# EAGLE design gyroscope-breakout (EAGLE 9.6.2)
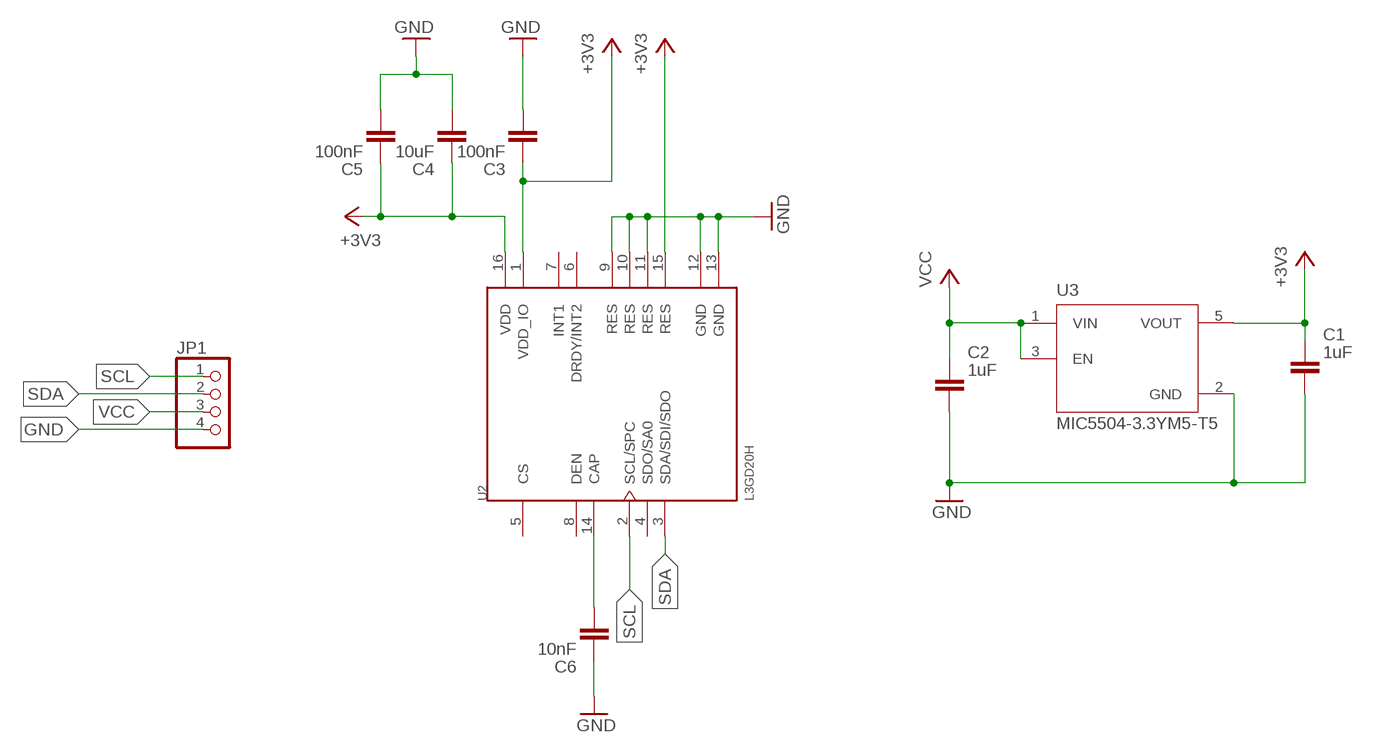
[diagram p0: schematic, sheet 1]

## Parts
C1  1uF  C_CHIP-1206(3216-METRIC)  [CAPC3216X135]
C2  1uF  C_CHIP-1206(3216-METRIC)  [CAPC3216X135]
C3  100nF  C_CHIP-1206(3216-METRIC)  [CAPC3216X135]
C4  10uF  C_CHIP-1206(3216-METRIC)  [CAPC3216X135]
C5  100nF  C_CHIP-1206(3216-METRIC)  [CAPC3216X135]
C6  10nF  C_CHIP-1206(3216-METRIC)  [CAPC3216X135]
JP1  PINHD-1X4  [1X04]
U2  L3GD20H  [LGA16R50P7X5_300X300X100]
U3  MIC5504-3.3YM5-T5  [SOT95P280X145-5N]

## Nets
+3V3: C1.1 C3.1 C4.1 C5.1 U2.1(VDD_IO) U2.15(RES) U2.16(VDD) U3.5(VOUT)
GND: C1.2 C2.2 C3.2 C4.2 C5.2 C6.1 JP1.4 U2.9(RES) U2.10(RES) U2.11(RES) U2.12(GND) U2.13(GND) U3.2(GND)
N$1: C6.2 U2.14(CAP)
SCL: JP1.1 U2.2(SCL/SPC)
SDA: JP1.2 U2.3(SDA/SDI/SDO)
VCC: C2.1 JP1.3 U3.1(VIN) U3.3(EN)
Unconnected: U2.4(SDO/SA0) U2.5(CS) U2.6(DRDY/INT2) U2.7(INT1) U2.8(DEN)

## Library data of the parts
C1-C6 = Capacitor:C: Capacitor - Generic; CATEGORY: Capacitor
JP1 = pinhead:PINHD-1X4: PIN HEADER
U2 = L3GD20H:L3GD20H: MEMS motion sensor: three-axis digital output gyroscope Buy Part <https://snapeda.com/parts/L3GD20H/STMicroelectronics/view-part/?ref=eda>; AVAILABILITY: Bad; DESCRIPTION: Gyroscope X (Pitch), Y (Roll), Z (Yaw) ±245, 500, 2000 6.25Hz ~ 400Hz I²C, SPI 16-LGA (3x3); MF: STMicroelectronics; MP: L3GD20H; PACKAGE: LGA-16 STMicroelectronics; PRICE: None
U3 = MIC5504-3.3YM5-T5:MIC5504-3.3YM5-T5: Linear Voltage Regulator IC 1 Output 300mA SOT-23-5 Buy Part <https://snapeda.com/parts/MIC5504-3.3YM5-T5/Microchip/view-part/?ref=eda>; ARROW_ELECTRONICS-PURCHASE-URL: https://snapeda.com/shop?store=Arrow+Electronics&id=1219468; AVAILABILITY: Good; DESCRIPTION: Linear Voltage Regulator IC 1 Output 300mA SOT-23-5; DIGIKEY-PURCHASE-URL: https://snapeda.com/shop?store=DigiKey&id=1219468; MF: Microchip; MOUSER-PURCHASE-URL: https://snapeda.com/shop?store=Mouser&id=1219468; MP: MIC5504-3.3YM5-T5; PACKAGE: SOT-23-5 Microchip; PRICE: None

## Board
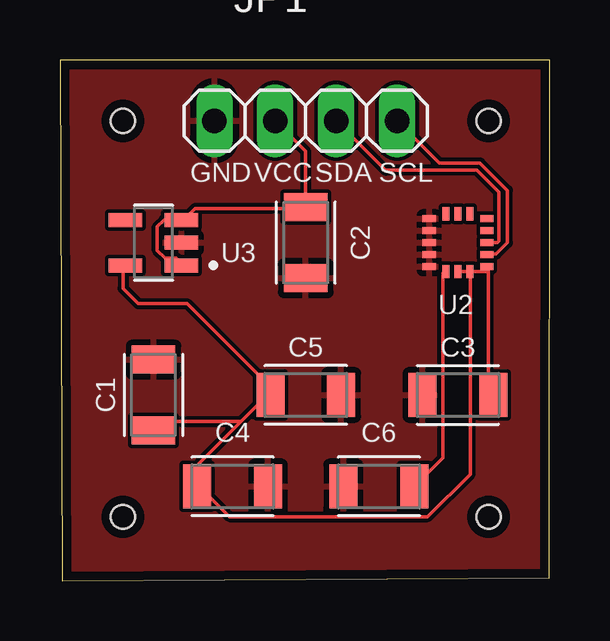
[diagram p1: board, top side]

Size 20.43 x 21.72 mm. Coordinates in mm from the lower left corner, seen from the top.
Outline: 0.09,0 20.41,0.13 20.43,21.72 0,21.72 0.09,0
Copper layers (1*16): Top 0.035559375mm / dielectric 1.6mm / Bottom 0.035559375mm
Design rules "oshpark-2layer": minimum track width 6mil, minimum drill 10mil, track to track 6mil, track to pad 6mil, pad to pad 6mil, via to via 6mil, smd to smd 6mil, copper to edge 15mil, drill to drill 6mil, minimum pad ring 5mil, minimum via ring 5mil, stop-mask expansion 2.5mil, vias tented up to drill 0mil, thermal gap 10mil
Holes 1 mm at 2.63,19.18 2.63,2.67 17.87,2.67 17.87,19.18

### Footprints (pad centres in the part's own frame; a part is rotated, then mirrored left to right if it is on the bottom)
CAPC3216X135 = smd 1.165 x 1.815: 1 -1.475,0; 2 1.475,0
1X04 = drill 1.016 long: 1 -3.81,0; 2 -1.27,0; 3 1.27,0; 4 3.81,0
LGA16R50P7X5_300X300X100 = smd 0.55 x 0.3: 1 -1.2,1; 2 -1.2,0.5; 3 -1.2,0; 4 -1.2,-0.5; 5 -1.2,-1; 9 1.2,-1; 10 1.2,-0.5; 11 1.2,0; 12 1.2,0.5; 13 1.2,1 | smd 0.3 x 0.55: 6 -0.5,-1.2; 7 0,-1.2; 8 0.5,-1.2; 14 0.5,1.2; 15 0,1.2; 16 -0.5,1.2
SOT95P280X145-5N = smd 1.39 x 0.58: 1 -1.165,0.95; 2 -1.165,0; 3 -1.165,-0.95; 4 1.165,-0.95; 5 1.165,0.95

### Placement (x,y rotation side)
C1  3.9,7.75 90 top
C2  10.25,14.1 270 top
C3  16.6,7.75 180 top
C4  7.2,3.94 0 top
C5  10.25,7.75 0 top
C6  13.3,3.94 0 top
JP1  10.25,19.18 180 top
U2  16.6,14.1 180 top
U3  3.9,14.1 180 top

### Tracks (layer width: path | path; a pad name or v marks a point on that pad's centre or on a via)
+3V3
  Top 0.152: 5.8,3.94 7.07,2.67 15.33,2.67 17.11,4.45 17.11,12.8 17.08,12.83 U2.16 | 7.55,6.64 5.8,4.89 5.8,3.94 | 7.55,6.64 8.66,7.75 C5.1 8.77,8.08 5.3,11.56 3.26,11.56 2.63,12.19 2.63,13.04 U3.5 | 5.8,3.94 C4.1 | C1.1 4.26,6.64 7.55,6.64 | 17.87,12.83 17.87,7.75 C3.1 | 17.87,12.83 17.87,12.99 U2.1 | U2.16 17.8,12.9 17.87,12.83 | U2.15 U2.16
GND
  pour Top: -2.45,24.26 -2.45,-2.41 22.95,-2.41 22.95,24.26
N$1
  Top 0.152: U2.14 15.96,12.83 15.96,5.13 C6.2
SCL
  Top 0.152: U2.2 17.87,13.62 18.19,13.62 18.66,14.1 18.66,16.27 17.52,17.42 15.82,17.42 JP1.1
SDA
  Top 0.152: JP1.2 13.58,17.11 17.39,17.11 18.3,16.2 18.3,14.17 18.23,14.1 U2.3
VCC
  Top 0.152: U3.1 5.01,13.3 4.85,13.46 4.38,13.46 4.06,13.78 4.06,14.76 4.34,15.05 U3.3 5.17,15.05 5.64,15.53 10.25,15.53 C2.1 10.25,17.91 JP1.3

### Text on the board
tNames: GND | VCC | SDA | SCL